# Altium schematic sheet Komponenta.SchDoc
size A
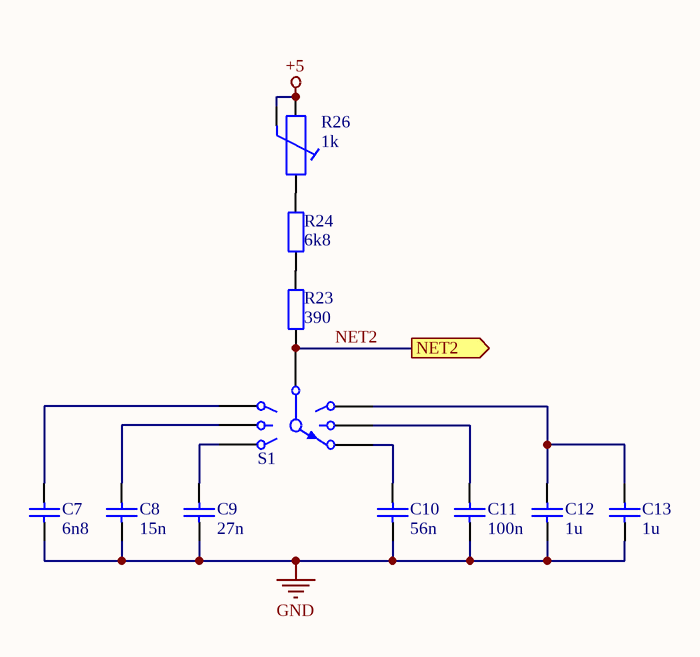
[diagram p0: Komponenta.SchDoc]

## Parts
C7  6n8  [RAD-0.3]
C8  15n  [RAD-0.3]
C9  27n  [RAD-0.3]
C10  56n  [RAD-0.3]
C11  100n  [RAD-0.3]
C12  1u  [RAD-0.3]
C13  1u  [RAD-0.3]
R23  390  [AXIAL-0.4]
R24  6k8  [AXIAL-0.4]
R26  1k  [6-0805_N]
S1  SW-6WAY  [SW-7]  (value not drawn)

## Ports
NET2 (out)

## Nets
+5: R26.1 R26.2
GND: C7.1 C8.1 C9.1 C10.1 C11.1 C12.1 C13.1
NET2: R23.2 S1.7 ; port NET2
NetC7_2: C7.2 S1.1
NetC8_2: C8.2 S1.2
NetC9_2: C9.2 S1.3
NetC10_2: C10.2 S1.6
NetC11_2: C11.2 S1.5
NetC12_2: C12.2 C13.2 S1.4
NetR23_1: R23.1 R24.2
NetR24_1: R24.1 R26.0

## Library data of the parts
C7-C13 = Cap: Capacitor; Published: 8-Jun-2000; LatestRevisionDate: 17-Jul-2002; LatestRevisionNote: Re-released for DXP Platform.; PackageReference: RAD-0.3; Publisher: Altium Limited; PackageDescription: Radial Cap, Thru-Hole; 2 Leads; 0.3 in Pin Spacing
R23 R24 = Res2: Resistor; Published: 8-Jun-2000; LatestRevisionDate: 17-Jul-2002; LatestRevisionNote: Re-released for DXP Platform.; PackageReference: AXIAL-0.4; Publisher: Altium Limited; PackageDescription: Axial Device, Thru-Hole; 2 Leads; 0.4 in Pin Spacing
R26 = Trimmer: Dobavljač: Farnell; Kat. broj: 514809
S1 = SW-6WAY: 6 Way Switch; Published: 24-Mar-1999; LatestRevisionDate: 17-Jul-2002; LatestRevisionNote: Re-released for DXP Platform.; PackageReference: SW-7; Publisher: Altium Limited; PackageDescription: Switch; 7 Leads